# EAGLE design Solar_Panel_Board_v5_1 (EAGLE 9.6.2)
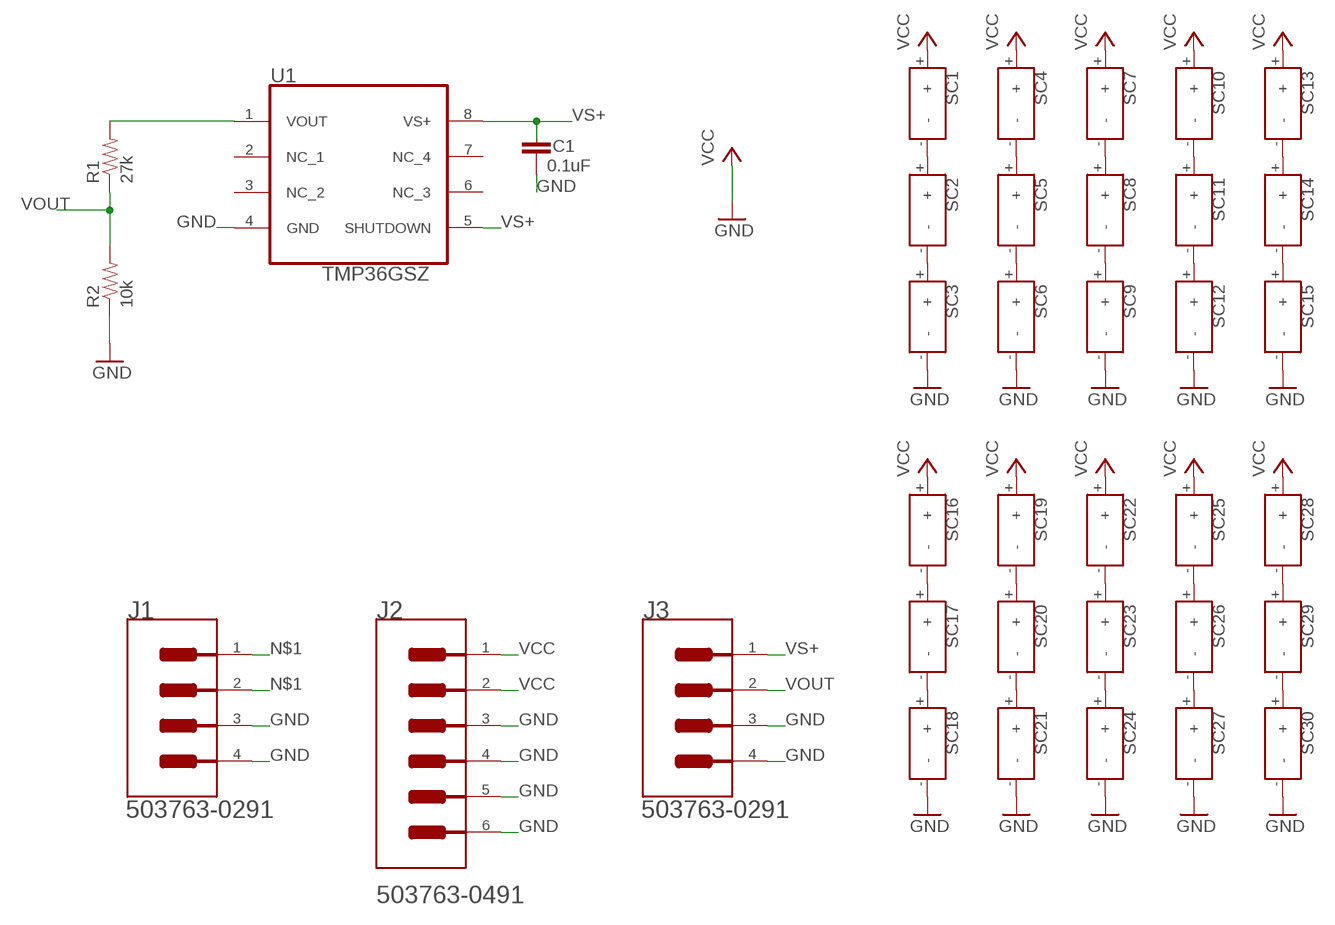
[diagram p0: schematic, sheet 1]

## Parts
C1  0.1uF  CAP0805  [0805]
J1  MOLEX_503763-0291MOLEX_503763-0291_0_0  [MOLEX_503763-0291_0]
J2  MOLEX_503763-0491MOLEX_503763-0491_0_0  [MOLEX_503763-0491_0]
J3  MOLEX_503763-0291MOLEX_503763-0291_0_0  [MOLEX_503763-0291_0]
R1  27k  RESISTOR0805-RES  [0805]
R2  10k  RESISTOR0805-RES  [0805]
SC1  KXOB25-05X3F  [KXOB25-05X3F]
SC2  KXOB25-05X3F  [KXOB25-05X3F]
SC3  KXOB25-05X3F  [KXOB25-05X3F]
SC4  KXOB25-05X3F  [KXOB25-05X3F]
SC5  KXOB25-05X3F  [KXOB25-05X3F]
SC6  KXOB25-05X3F  [KXOB25-05X3F]
SC7  KXOB25-05X3F  [KXOB25-05X3F]
SC8  KXOB25-05X3F  [KXOB25-05X3F]
SC9  KXOB25-05X3F  [KXOB25-05X3F]
SC10  KXOB25-05X3F  [KXOB25-05X3F]
SC11  KXOB25-05X3F  [KXOB25-05X3F]
SC12  KXOB25-05X3F  [KXOB25-05X3F]
SC13  KXOB25-05X3F  [KXOB25-05X3F]
SC14  KXOB25-05X3F  [KXOB25-05X3F]
SC15  KXOB25-05X3F  [KXOB25-05X3F]
SC16  KXOB25-05X3F  [KXOB25-05X3F]
SC17  KXOB25-05X3F  [KXOB25-05X3F]
SC18  KXOB25-05X3F  [KXOB25-05X3F]
SC19  KXOB25-05X3F  [KXOB25-05X3F]
SC20  KXOB25-05X3F  [KXOB25-05X3F]
SC21  KXOB25-05X3F  [KXOB25-05X3F]
SC22  KXOB25-05X3F  [KXOB25-05X3F]
SC23  KXOB25-05X3F  [KXOB25-05X3F]
SC24  KXOB25-05X3F  [KXOB25-05X3F]
SC25  KXOB25-05X3F  [KXOB25-05X3F]
SC26  KXOB25-05X3F  [KXOB25-05X3F]
SC27  KXOB25-05X3F  [KXOB25-05X3F]
SC28  KXOB25-05X3F  [KXOB25-05X3F]
SC29  KXOB25-05X3F  [KXOB25-05X3F]
SC30  KXOB25-05X3F  [KXOB25-05X3F]
U1  TMP36GSZ  [SOIC127P600X175-8N]

## Nets
GND: C1.2 J1.3(MNT_1) J1.4(MNT_2) J2.3 J2.4 J2.5(MNT_1) J2.6(MNT_2) J3.3(MNT_1) J3.4(MNT_2) R2.1 SC3.- SC6.- SC9.- SC12.- SC15.- SC18.- SC21.- SC24.- SC27.- SC30.- U1.4(GND)
N$1: J1.1 J1.2
N$2: SC7.- SC8.+
N$3: SC4.- SC5.+
N$4: SC5.- SC6.+
N$5: SC2.- SC3.+
N$6: SC1.- SC2.+
N$7: SC8.- SC9.+
N$8: SC16.- SC17.+
N$9: SC14.- SC15.+
N$10: SC13.- SC14.+
N$11: SC10.- SC11.+
N$12: R1.2 U1.1(VOUT)
N$13: SC11.- SC12.+
N$14: SC23.- SC24.+
N$15: SC20.- SC21.+ SC22.- SC23.+
N$18: SC17.- SC18.+
N$19: SC19.- SC20.+
N$21: SC28.- SC29.+
N$22: SC29.- SC30.+
N$23: SC26.- SC27.+
N$24: SC25.- SC26.+
VCC: J2.1 J2.2 SC1.+ SC4.+ SC7.+ SC10.+ SC13.+ SC16.+ SC19.+ SC22.+ SC25.+ SC28.+ ; supply symbol labelled GND
VOUT: J3.2 R1.1 R2.2
VS+: C1.1 J3.1 U1.5(SHUTDOWN) U1.8(VS+)
Unconnected: U1.2(NC_1) U1.3(NC_2) U1.6(NC_3) U1.7(NC_4)

## Library data of the parts
C1 = HSFL_Main_Library:CAP: Capacitor Standard 0603 ceramic capacitor, and 0.1" leaded capacitor.
J1 J3 = Molex - 503763-0291:MOLEX_503763-0291: 2 Positions Header Connector 0.039" (1.00mm) Surface Mount, Right Angle Gold; CENTROID_NOT_SPECIFIED: No; DATASHEET: http://www.molex.com/pdm_docs/sd/5037630291_sd.pdf; DIGIKEY_DESCRIPTION: CONN HEADER 1MM R/A 2CKT; DIGIKEY_PART_NUMBER: WM10654CT-ND; LEAD_FREE: yes; MF: Molex; MOUSER_PART_NUMBER: 538-503763-0291; MPN: 503763-0291; PACKAGE: HDR02; PREFIX: J; ROHS: yes; TEMPERATURE_RANGE_HIGH: +105°C; TEMPERATURE_RANGE_LOW: -40°C
J2 = Molex - 503763-0491:MOLEX_503763-0491: Wire-To-Board Connector, Pico-Lock 503763 Series, Surface Mount, Header, 4 Contacts, 1 mm; AUTOMOTIVE: No; CENTROID_NOT_SPECIFIED: No; CONN_GENDER: Male; CONN_ORIENTATION: Right Angle; CONTACT_MATERIAL: Gold,Nickel; CURRENT_RATING: 1.5A; DATASHEET: https://www.molex.com/webdocs/datasheets/pdf/en-us/5037630491_PCB_HEADERS.pdf; DEVICE_CLASS_L1: Connectors; DEVICE_CLASS_L2: Headers and Wire Housings; DEVICE_CLASS_L3: unset; DIGIKEY_DESCRIPTION: CONN HEADER 1MM R/A 4CKT; DIGIKEY_PART_NUMBER: WM10655CT-ND; FOOTPRINT_URL: https://www.molex.com/pdm_docs/sd/5037630491_sd.pdf; FOOTPRINT_VARIANT_NAME_0: Recommended_Land_Pattern; HEIGHT: 1.7mm; LEAD_FREE: Yes; MF: Molex; MFG_PACKAGE_IDENT: 503763-0491; MFG_PACKAGE_IDENT_DATE: 0; MFG_PACKAGE_IDENT_REV: 0; MOUSER_PART_NUMBER: 538-503763-0491; MPN: 503763-0491; NUMBER_OF_CONTACTS: 4; NUMBER_OF_ROWS: 1; PACKAGE: HDR4; PITCH: 1mm; PREFIX: J; ROHS: Yes; TEMPERATURE_RANGE_HIGH: +105°C; TEMPERATURE_RANGE_LOW: -40°C; VERIFICATION_VERSION: 0.0.0.1; VOLTAGE_RATING: 150V
R1 R2 = HSFL_Main_Library:RESISTOR: Resistor Basic schematic elements and footprints for 0603, 1206, and PTH resistors.
SC1-SC30 = untitled:KXOB25-05X3F: KXOB25-05X3F - Monocrystalline Solar Cell 30.7mW, 2.07V
U1 = TMP36GSZ:TMP36GSZ

## Board
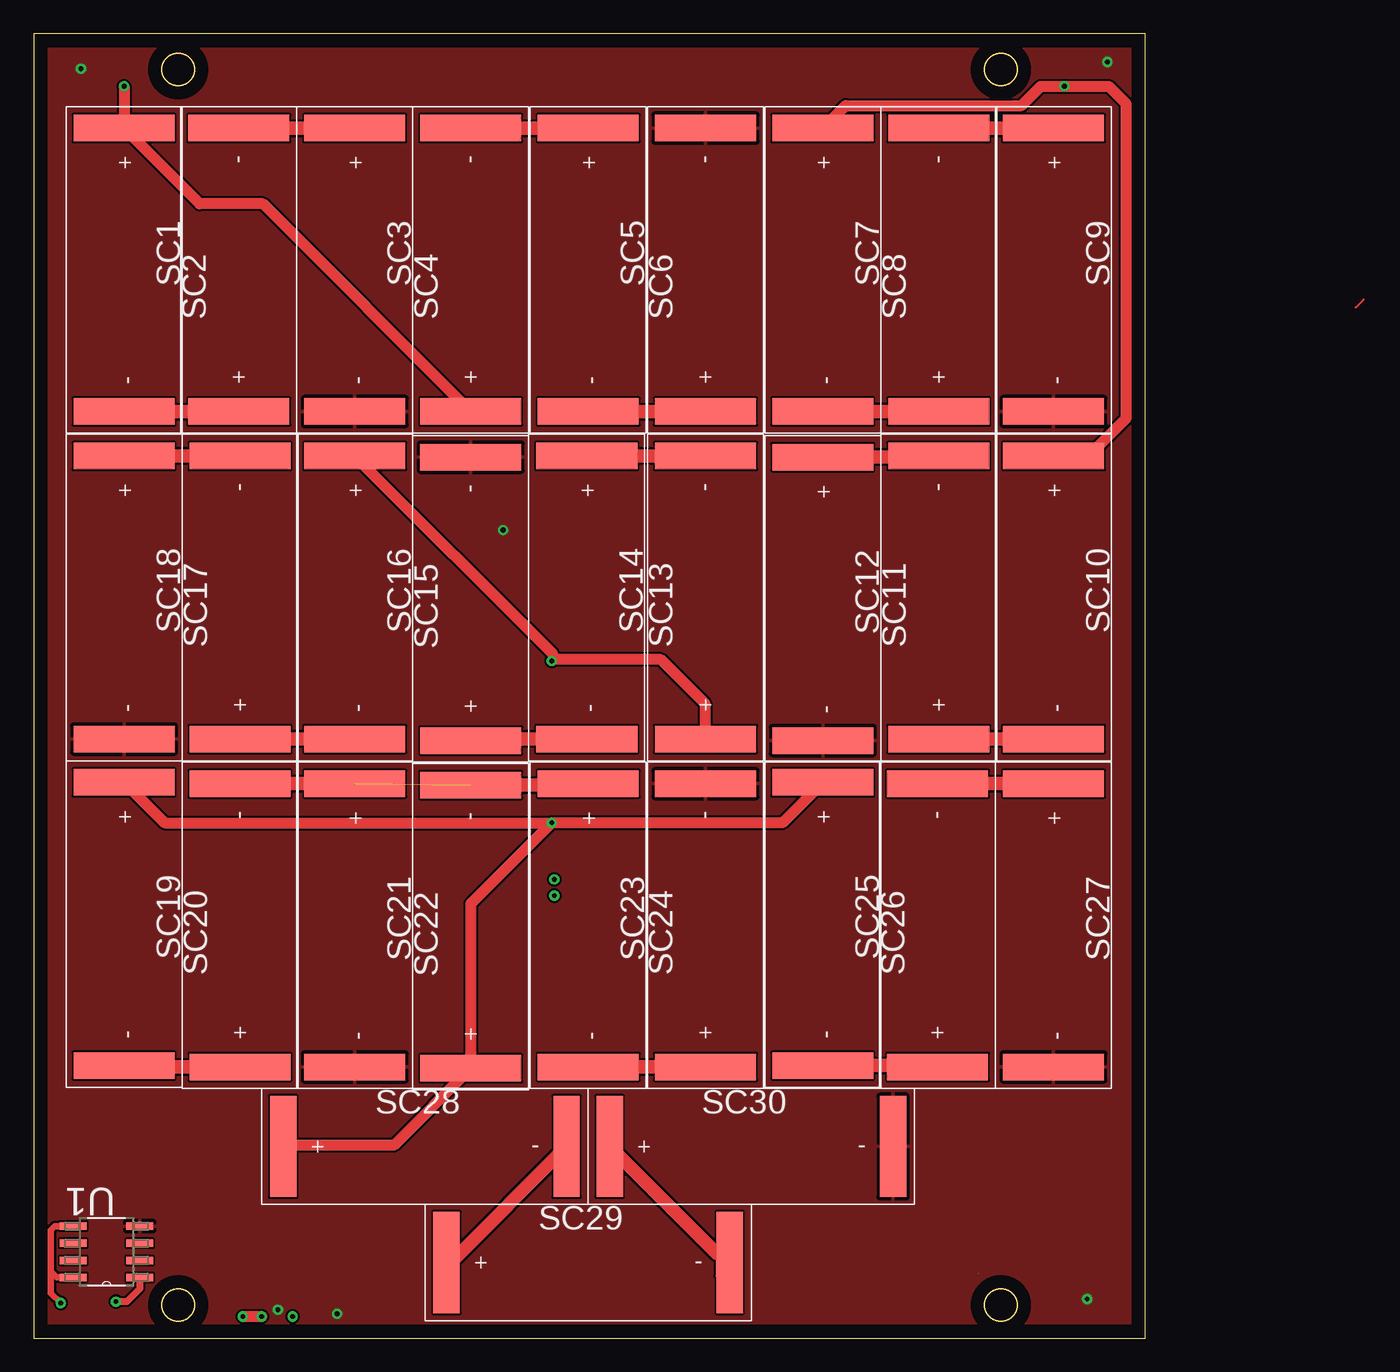
[diagram p1: board, top side]
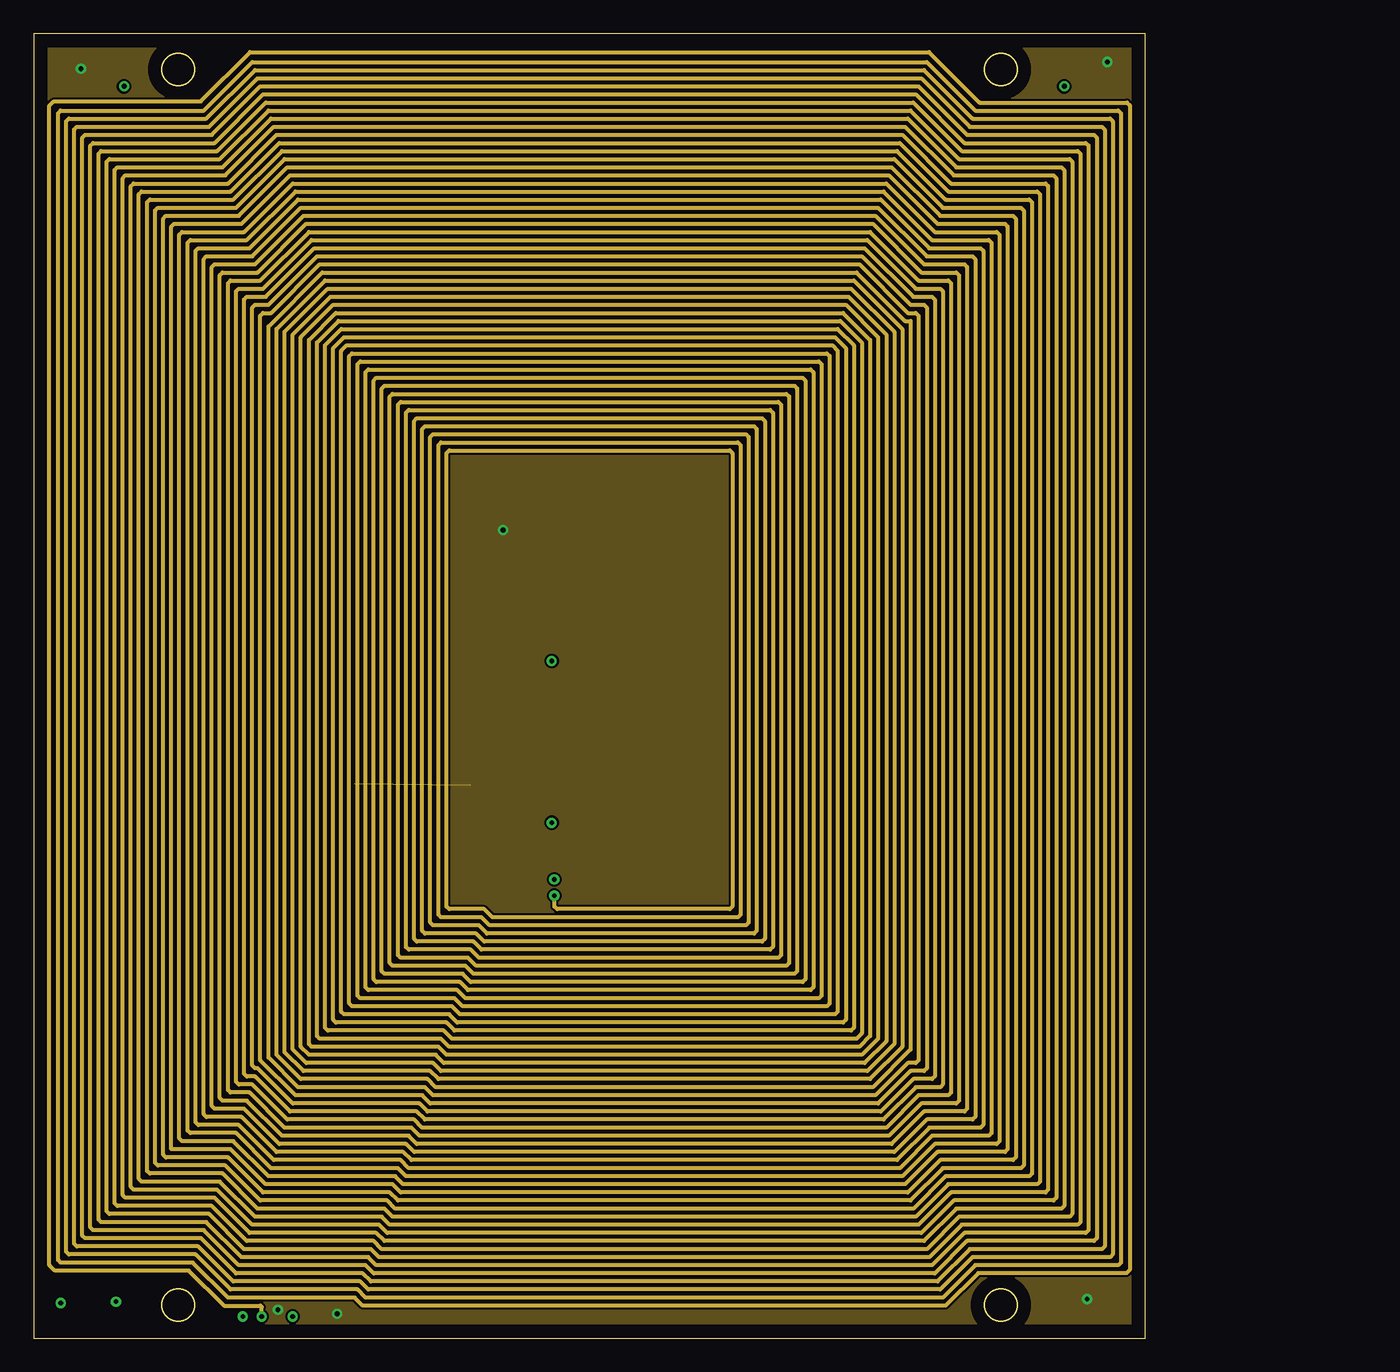
[diagram p2: board, inner layer Route2]
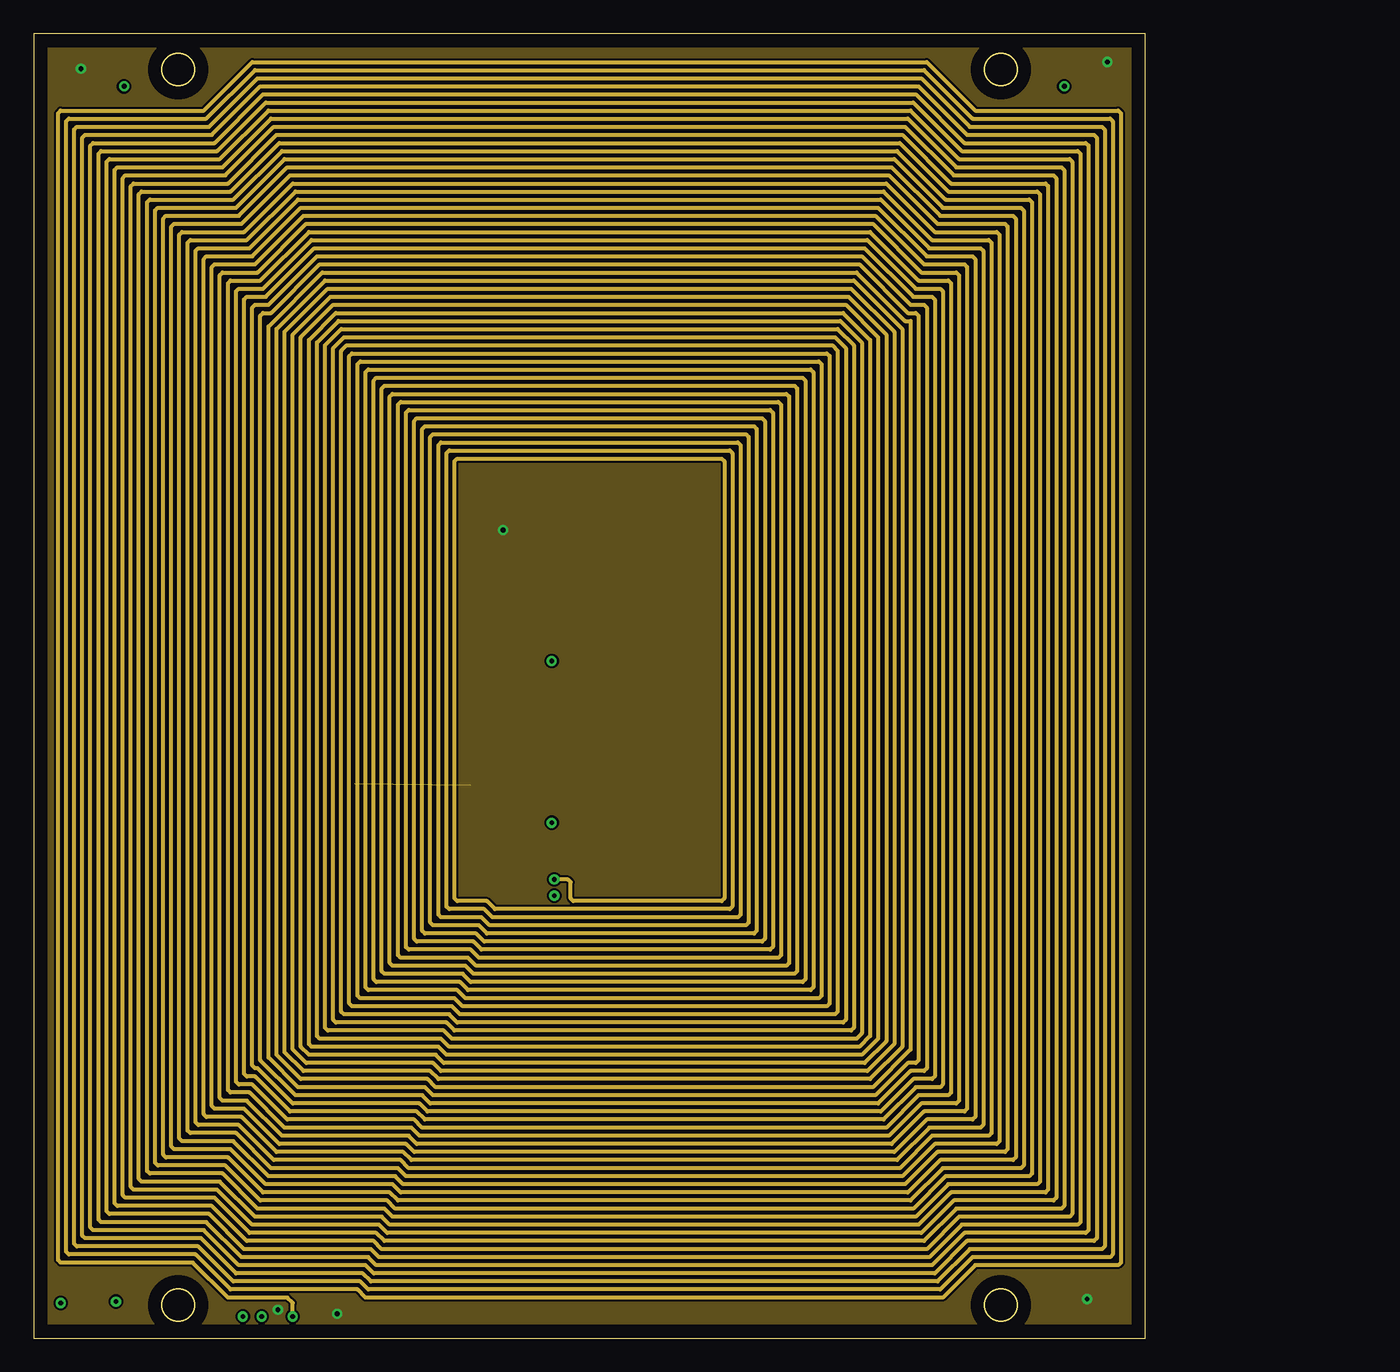
[diagram p3: board, inner layer Route3]
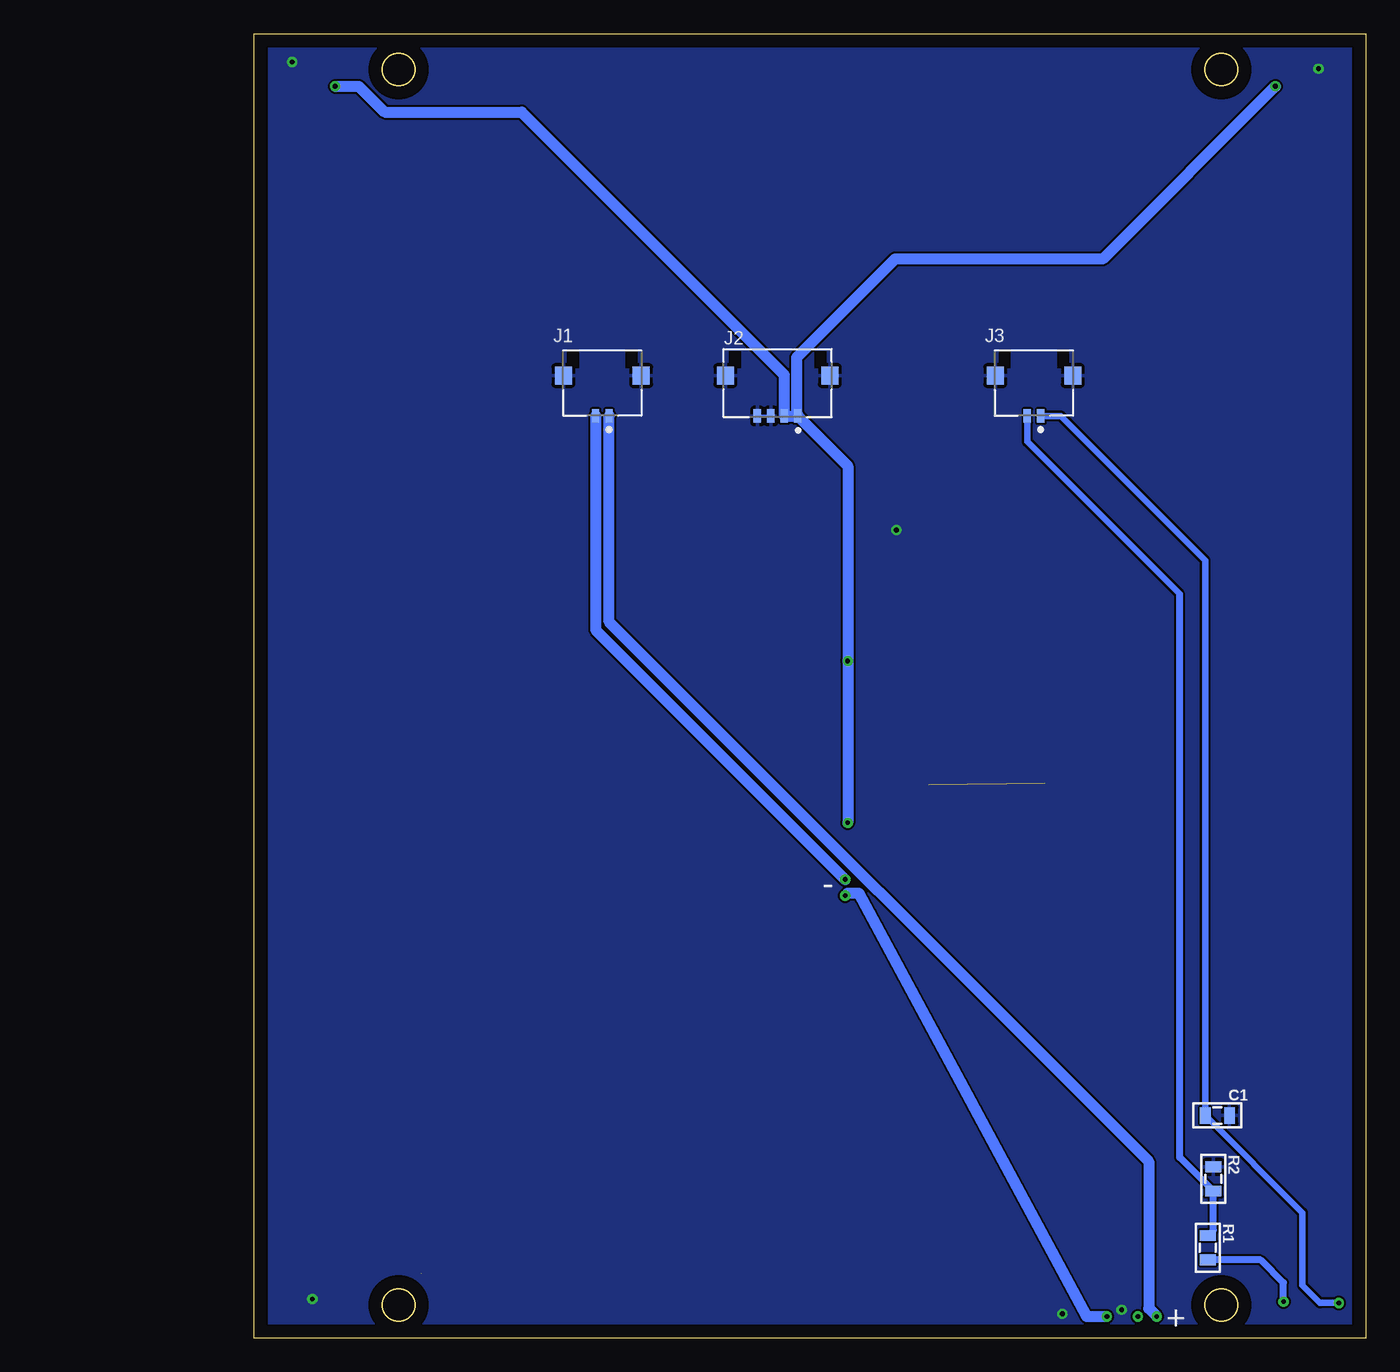
[diagram p4: board, bottom side, seen from below]

Size 82.42 x 96.7 mm. Coordinates in mm from the lower left corner, seen from the top.
Outline: 82.42,96.7 0,96.7 0,0 82.42,0 82.42,96.7
Outline: circle at 10.71,2.45 radius 1.2
Outline: circle at 71.71,2.45 radius 1.2
Outline: circle at 71.71,94.05 radius 1.2
Outline: circle at 10.71,94.05 radius 1.2
Copper layers (1+2*3+16): Top 0.035mm / dielectric 1.5mm / Route2 0.035mm / dielectric 0.15mm / Route3 0.035mm / dielectric 0.2mm / Bottom 0.035mm
Design rules "default *": minimum track width 6mil, minimum drill 0.35mm, track to track 6mil, track to pad 6mil, pad to pad 6mil, via to via 6mil, smd to smd 6mil, copper to edge 40mil, drill to drill 6mil, minimum pad ring 10mil, minimum via ring 8mil, stop-mask expansion 4mil, vias tented up to drill 0mil, thermal gap 10mil
Holes 2.4 mm at 10.71,94.05 71.71,94.05 10.71,2.45 71.71,2.45

### Footprints (pad centres in the part's own frame; a part is rotated, then mirrored left to right if it is on the bottom)
0805 = smd 0.8 x 1.2: 1 -0.9,0; 2 0.9,0
MOLEX_503763-0291_0 = smd 0.55 x 1: 1 0.5,-2.435; 2 -0.5,-2.435 | smd 1.26 x 1.3: 3 -2.875,0.555; 4 2.875,0.555
MOLEX_503763-0491_0 = smd 0.55 x 1: 1 1.5,-2.435; 2 0.5,-2.435; 3 -0.5,-2.435; 4 -1.5,-2.435 | smd 1.26 x 1.3: 5 -3.875,0.555; 6 3.875,0.555
KXOB25-05X3F = smd 1.96 x 7.49: + -10.5,0; - 10.5,0
SOIC127P600X175-8N = smd 1.981 x 0.559: 1 -2.464,1.905; 2 -2.464,0.635; 3 -2.464,-0.635; 4 -2.464,-1.905; 5 2.464,-1.905; 6 2.464,-0.635; 7 2.464,0.635; 8 2.464,1.905

### Placement (x,y rotation side)
C1  11,16.5 0 bottom
J1  56.6,70.8 0 bottom
J2  43.6,70.8 0 bottom
J3  24.6,70.8 0 bottom
R1  11.7,6.7 270 bottom
R2  11.3,11.8 270 bottom
SC1  6.7,79.2 270 top
SC2  15.2,79.2 90 top
SC3  23.8,79.2 270 top
SC4  32.4,79.2 90 top
SC5  41.1,79.2 270 top
SC6  49.8,79.2 90 top
SC7  58.5,79.2 270 top
SC8  67.1,79.2 90 top
SC9  75.6,79.2 270 top
SC10  75.6,54.9 270 top
SC11  67.1,54.9 90 top
SC12  58.5,54.8 270 top
SC13  49.8,54.9 90 top
SC14  41,54.9 270 top
SC15  32.4,54.8 90 top
SC16  23.8,54.9 270 top
SC17  15.3,54.9 90 top
SC18  6.7,54.9 270 top
SC19  6.7,30.7 270 top
SC20  15.3,30.6 90 top
SC21  23.8,30.6 270 top
SC22  32.4,30.5 90 top
SC23  41.1,30.6 270 top
SC24  49.8,30.6 90 top
SC25  58.5,30.7 270 top
SC26  67,30.6 90 top
SC27  75.6,30.6 270 top
SC28  29,14.2 0 top
SC29  41.1,5.6 0 top
SC30  53.2,14.2 0 top
U1  5.4,6.4 180 top

### Tracks (layer width: path | path; a pad name or v marks a point on that pad's centre or on a via)
GND  (via drill 0.35)
  Top 0.152: SC12.- 58.5,44.4 | 21.2,68.7 SC3.- 26.5,68.7
  Bottom 0.152: J2.3 J2.4
  other vias: 22.5,1.8 18.1,2.1 34.8,59.9 78.1,2.9 79.6,94.6 3.5,94.1
  pour Top: -1,98 84,98 84,-1 -1,-1
  pour Route2: -2,99 85,99 85,-2 -2,-2
  pour Route3: -3,100 86,100 86,-3 -3,-3
  pour Bottom: -4,101 87,101 87,-4 -4,-4
N$1  (via drill 0.35)  (1 unrouted)
  Top 0.813: v15.5,1.6 v16.9,1.6
  Route2 0.3: v16.9,1.6 16.9,2.3 16.8,2.4 14.11,2.4 11.51,5 1.57,5 1.17,5.4 1.17,91.37 1.48,91.68 12.39,91.68 16.04,95.33 66.38,95.33 70.11,91.6 81.05,91.6 81.25,91.4 81.25,5.05 81.02,4.82 70.03,4.82 | 70.02,4.82 67.6,2.4 24.4,2.4 23.8,3 14.4,3 11.8,5.6 2,5.6 1.8,5.8 1.8,90.8 2,91 12.6,91 16.2,94.6 66.2,94.6 69.8,91 80.4,91 80.6,90.8 80.6,5.6 80.4,5.4 69.8,5.4 67.4,3 24.6,3 24,3.6 14.6,3.6 12,6.2 2.6,6.2 2.4,6.4 2.4,90.2 2.6,90.4 12.8,90.4 16.4,94 66,94 69.6,90.4 79.8,90.4 80,90.2 80,6.2 79.8,6 69.6,6 67.2,3.6 24.8,3.6 24.2,4.2 14.8,4.2 12.2,6.8 3.2,6.8 3,7 3,89.6 3.2,89.8 13,89.8 16.6,93.4 65.8,93.4 69.4,89.8 79.2,89.8 79.4,89.6 79.4,6.8 79.2,6.6 69.4,6.6 67,4.2 25,4.2 24.4,4.8 15,4.8 12.4,7.4 3.8,7.4 3.6,7.6 3.6,89 3.8,89.2 13.2,89.2 16.8,92.8 65.6,92.8 69.2,89.2 78.6,89.2 78.8,89 78.8,7.4 78.6,7.2 69.2,7.2 66.8,4.8 25.2,4.8 24.6,5.4 15.2,5.4 12.6,8 4.4,8 4.2,8.2 4.2,88.4 4.4,88.6 13.4,88.6 17,92.2 65.4,92.2 69,88.6 78,88.6 78.2,88.4 78.2,8 78,7.8 69,7.8 66.6,5.4 25.4,5.4 24.8,6 15.4,6 12.8,8.6 5,8.6 4.8,8.8 4.8,87.8 5,88 13.6,88 17.2,91.6 65.2,91.6 68.8,88 77.4,88 77.6,87.8 77.6,8.6 77.4,8.4 68.8,8.4 66.4,6 25.6,6 25,6.6 15.6,6.6 13,9.2 5.6,9.2 5.4,9.4 5.4,87.2 5.6,87.4 13.8,87.4 17.4,91 65,91 68.6,87.4 76.8,87.4 77,87.2 77,9.2 76.8,9 68.6,9 66.2,6.6 25.8,6.6 25.2,7.2 15.8,7.2 13.2,9.8 6.2,9.8 6,10 6,86.6 6.2,86.8 14,86.8 17.6,90.4 64.8,90.4 68.4,86.8 76.2,86.8 76.4,86.6 76.4,9.8 76.2,9.6 68.4,9.6 66,7.2 26,7.2 25.4,7.8 16,7.8 13.4,10.4 6.8,10.4 6.6,10.6 6.6,86 6.8,86.2 14.2,86.2 17.8,89.8 64.6,89.8 68.2,86.2 75.6,86.2 75.8,86 75.8,10.4 75.6,10.2 68.2,10.2 65.8,7.8 26.2,7.8 25.6,8.4 16.2,8.4 13.6,11 7.4,11 7.2,11.2 7.2,85.4 7.4,85.6 14.4,85.6 18,89.2 64.4,89.2 68,85.6 75,85.6 75.2,85.4 75.2,11 75,10.8 68,10.8 65.6,8.4 26.4,8.4 25.8,9 16.4,9 13.8,11.6 8,11.6 7.8,11.8 7.8,84.8 8,85 14.6,85 18.2,88.6 64.2,88.6 67.8,85 74.4,85 74.6,84.8 74.6,11.6 74.4,11.4 67.8,11.4 65.4,9 26.6,9 26,9.6 16.6,9.6 14,12.2 8.6,12.2 8.4,12.4 8.4,84.2 8.6,84.4 14.8,84.4 18.4,88 64,88 67.6,84.4 73.8,84.4 74,84.2 74,12.2 73.8,12 67.6,12 65.2,9.6 26.8,9.6 26.2,10.2 16.8,10.2 14.2,12.8 9.2,12.8 9,13 9,83.6 9.2,83.8 15,83.8 18.6,87.4 63.8,87.4 67.4,83.8 73.2,83.8 73.4,83.6 73.4,12.8 73.2,12.6 67.4,12.6 65,10.2 27,10.2 26.4,10.8 17,10.8 14.4,13.4 9.8,13.4 9.6,13.6 9.6,83 9.8,83.2 15.2,83.2 18.8,86.8 63.6,86.8 67.2,83.2 72.6,83.2 72.8,83 72.8,13.4 72.6,13.2 67.2,13.2 64.8,10.8 27.2,10.8 26.6,11.4 17.2,11.4 14.6,14 10.2,14 10.2,82.4 10.4,82.6 15.4,82.6 19,86.2 63.4,86.2 67,82.6 72,82.6 72.2,82.4 72.2,14 72,13.8 67,13.8 64.6,11.4 27.4,11.4 26.8,12 17.4,12 14.8,14.6 11,14.6 10.8,14.8 10.8,81.8 11,82 15.6,82 19.2,85.6 63.2,85.6 66.8,82 71.4,82 71.6,81.8 71.6,14.6 71.4,14.4 66.8,14.4 64.4,12 27.6,12 27,12.6 17.6,12.6 15,15.2 11.6,15.2 11.4,15.4 11.4,81.2 11.6,81.4 15.8,81.4 19.4,85 63,85 66.6,81.4 70.8,81.4 71,81.2 71,15.2 70.8,15 66.6,15 64.2,12.6 27.8,12.6 27.2,13.2 17.8,13.2 15.2,15.8 12.2,15.8 12,16 12,80.6 12.2,80.8 16,80.8 19.6,84.4 62.8,84.4 66.4,80.8 70.2,80.8 70.4,80.6 70.4,15.8 70.2,15.6 66.4,15.6 64,13.2 28,13.2 27.4,13.8 18,13.8 15.4,16.4 12.8,16.4 12.6,16.6 12.6,80 12.8,80.2 16.2,80.2 19.8,83.8 62.6,83.8 66.2,80.2 69.6,80.2 69.8,80 69.8,16.4 69.6,16.2 66.2,16.2 63.8,13.8 28.2,13.8 27.6,14.4 18.2,14.4 15.6,17 13.4,17 13.2,17.2 13.2,79.4 13.4,79.6 16.4,79.6 20,83.2 62.4,83.2 66,79.6 69,79.6 69.2,79.4 69.2,17 69,16.8 66,16.8 63.6,14.4 28.4,14.4 27.8,15 18.4,15 15.8,17.6 14,17.6 13.8,17.8 13.8,78.8 14,79 16.6,79 20.2,82.6 62.2,82.6 65.8,79 68.4,79 68.6,78.8 68.6,17.6 68.4,17.4 65.8,17.4 63.4,15 28.6,15 28,15.6 18.6,15.6 16,18.2 14.6,18.2 14.4,18.4 14.4,78.2 14.6,78.4 16.8,78.4 20.4,82 62,82 65.6,78.4 67.8,78.4 68,78.2 68,18.2 67.8,18 65.6,18 63.2,15.6 28.8,15.6 28.2,16.2 18.8,16.2 16.2,18.8 15.2,18.8 15,19 15,77.6 15.2,77.8 17,77.8 20.6,81.4 61.8,81.4 65.4,77.8 67.2,77.8 67.4,77.6 67.4,18.8 67.2,18.6 65.4,18.6 63,16.2 29,16.2 28.4,16.8 19,16.8 16.4,19.4 15.8,19.4 15.6,19.6 15.6,77 15.8,77.2 17.2,77.2 20.8,80.8 61.6,80.8 65.2,77.2 66.6,77.2 66.8,77 66.8,19.4 66.6,19.2 65.2,19.2 62.8,16.8 29.2,16.8 28.6,17.4 19.2,17.4 16.6,20 16.4,20 16.2,20.2 16.2,76.4 16.4,76.6 17.4,76.6 21,80.2 61.4,80.2 65,76.6 66,76.6 66.2,76.4 66.2,20 66,19.8 65,19.8 62.6,17.4 29.4,17.4 28.8,18 19.4,18 16.8,20.6 16.8,75.8 17,76 17.6,76 21.2,79.6 61.2,79.6 64.8,76 65.4,76 65.6,75.8 65.6,20.6 65.4,20.4 64.8,20.4 62.4,18 29.6,18 29,18.6 19.6,18.6 17.4,20.8 17.4,75 21.4,79 61,79 64.6,75.4 65,75.4 65,21.4 62.2,18.6 29.8,18.6 29.2,19.2 19.8,19.2 18,21 18,74.8 21.6,78.4 60.8,78.4 64.4,74.8 64.4,21.6 62,19.2 30,19.2 29.4,19.8 20,19.8 18.6,21.2 18.6,74.6 21.8,77.8 60.6,77.8 63.8,74.6 63.8,21.8 61.8,19.8 30.2,19.8 29.6,20.4 20.2,20.4 19.2,21.4 19.2,74.4 22,77.2 60.4,77.2 63.2,74.4 63.2,22 61.6,20.4 30.4,20.4 29.8,21 20.4,21 19.8,21.6 19.8,74.2 22.2,76.6 60.2,76.6 62.6,74.2 62.6,22.2 61.4,21 30.6,21 30,21.6 20.6,21.6 20.4,21.8 20.4,74 22.4,76 60,76 62,74 62,22.4 61.2,21.6 30.8,21.6 30.2,22.2 21.2,22.2 21,22.4 21,73.8 22.6,75.4 59.8,75.4 61.4,73.8 61.4,22.6 61,22.2 31,22.2 30.4,22.8 21.8,22.8 21.6,23 21.6,73.6 22.8,74.8 59.6,74.8 60.8,73.6 60.8,23 60.6,22.8 31.2,22.8 30.6,23.4 22.4,23.4 22.2,23.6 22.2,73.4 23,74.2 59.4,74.2 60.2,73.4 60.2,23.6 60,23.4 31.4,23.4 30.8,24 23,24 22.8,24.2 22.8,73.2 23.2,73.6 59.2,73.6 59.6,73.2 59.6,24.2 59.4,24 31.6,24 31,24.6 23.6,24.6 23.4,24.8 23.4,72.8 23.6,73 58.8,73 59,72.8 59,24.8 58.8,24.6 31.8,24.6 31.2,25.2 24.2,25.2 24,25.4 24,72.2 24.2,72.4 58.2,72.4 58.4,72.2 58.4,25.4 58.2,25.2 32,25.2 31.4,25.8 24.8,25.8 24.6,26 24.6,71.6 24.8,71.8 57.6,71.8 57.8,71.6 57.8,26 57.6,25.8 32.2,25.8 31.6,26.4 25.4,26.4 25.2,26.6 25.2,71 25.4,71.2 57,71.2 57.2,71 57.2,26.6 57,26.4 32.4,26.4 31.8,27 26,27 25.8,27.2 25.8,70.4 26,70.6 56.4,70.6 56.6,70.4 56.6,27.2 56.4,27 32.6,27 32,27.6 26.6,27.6 26.4,27.8 26.4,69.8 26.6,70 55.8,70 56,69.8 56,27.8 55.8,27.6 32.8,27.6 32.2,28.2 27.2,28.2 27,28.4 27,69.2 27.2,69.4 55.2,69.4 55.4,69.2 55.4,28.4 55.2,28.2 33,28.2 32.4,28.8 27.8,28.8 27.6,29 27.6,68.6 27.8,68.8 54.6,68.8 54.8,68.6 54.8,29 54.6,28.8 33.2,28.8 32.6,29.4 28.4,29.4 28.2,29.6 28.2,68 28.4,68.2 54,68.2 54.2,68 54.2,29.6 54,29.4 33.4,29.4 32.8,30 29,30 28.8,30.2 28.8,67.4 29,67.6 53.4,67.6 53.6,67.4 53.6,30.2 53.4,30 33.6,30 33,30.6 29.6,30.6 29.4,30.8 29.4,66.8 29.6,67 52.8,67 53,66.8 53,30.8 52.8,30.6 33.8,30.6 33.2,31.2 30.2,31.2 30,31.4 30,66.2 30.2,66.4 52.2,66.4 52.4,66.2 52.4,31.4 52.2,31.2 34,31.2 33.4,31.8 30.8,31.8 30.6,32 30.6,65.6 30.8,65.8 51.6,65.8 51.8,65.6 51.8,32 51.6,31.8 38.8,31.8 38.6,32 v38.6,32.8
  Route3 0.3: v38.6,34 39.6,34 39.8,33.8 39.8,32.6 40,32.4 51,32.4 51.2,32.6 51.2,65 51,65.2 31.4,65.2 31.2,65 31.2,32.6 31.4,32.4 33.6,32.4 34.2,31.8 51.6,31.8 51.8,32 51.8,65.6 51.6,65.8 30.8,65.8 30.6,65.6 30.6,32 30.8,31.8 33.4,31.8 34,31.2 52.2,31.2 52.4,31.4 52.4,66.2 52.2,66.4 30.2,66.4 30,66.2 30,31.4 30.2,31.2 33.2,31.2 33.8,30.6 52.8,30.6 53,30.8 53,66.8 52.8,67 29.6,67 29.4,66.8 29.4,30.8 29.6,30.6 33,30.6 33.6,30 53.4,30 53.6,30.2 53.6,67.4 53.4,67.6 29,67.6 28.8,67.4 28.8,30.2 29,30 32.8,30 33.4,29.4 54,29.4 54.2,29.6 54.2,68 54,68.2 28.4,68.2 28.2,68 28.2,29.6 28.4,29.4 32.6,29.4 33.2,28.8 54.6,28.8 54.8,29 54.8,68.6 54.6,68.8 27.8,68.8 27.6,68.6 27.6,29 27.8,28.8 32.4,28.8 33,28.2 55.2,28.2 55.4,28.4 55.4,69.2 55.2,69.4 27.2,69.4 27,69.2 27,28.4 27.2,28.2 32.2,28.2 32.8,27.6 55.8,27.6 56,27.8 56,69.8 55.8,70 26.6,70 26.4,69.8 26.4,27.8 26.6,27.6 32,27.6 32.6,27 56.4,27 56.6,27.2 56.6,70.4 56.4,70.6 26,70.6 25.8,70.4 25.8,27.2 26,27 31.8,27 32.4,26.4 57,26.4 57.2,26.6 57.2,71 57,71.2 25.4,71.2 25.2,71 25.2,26.6 25.4,26.4 31.6,26.4 32.2,25.8 57.6,25.8 57.8,26 57.8,71.6 57.6,71.8 24.8,71.8 24.6,71.6 24.6,26 24.8,25.8 31.4,25.8 32,25.2 58.2,25.2 58.4,25.4 58.4,72.2 58.2,72.4 24.2,72.4 24,72.2 24,25.4 24.2,25.2 31.2,25.2 31.8,24.6 58.8,24.6 59,24.8 59,72.8 58.8,73 23.6,73 23.4,72.8 23.4,24.8 23.6,24.6 31,24.6 31.6,24 59.4,24 59.6,24.2 59.6,73.2 59.2,73.6 23.2,73.6 22.8,73.2 22.8,24.2 23,24 30.8,24 31.4,23.4 60,23.4 60.2,23.6 60.2,73.4 59.4,74.2 23,74.2 22.2,73.4 22.2,23.6 22.4,23.4 30.6,23.4 31.2,22.8 60.6,22.8 60.8,23 60.8,73.6 59.6,74.8 22.8,74.8 21.6,73.6 21.6,23 21.8,22.8 30.4,22.8 31,22.2 61,22.2 61.4,22.6 61.4,73.8 59.8,75.4 22.6,75.4 21,73.8 21,22.4 21.2,22.2 30.2,22.2 30.8,21.6 61.2,21.6 62,22.4 62,74 60,76 22.4,76 20.4,74 20.4,21.8 20.6,21.6 30,21.6 30.6,21 61.4,21 62.6,22.2 62.6,74.2 60.2,76.6 22.2,76.6 19.8,74.2 19.8,21.6 20.4,21 29.8,21 30.4,20.4 61.6,20.4 63.2,22 63.2,74.4 60.4,77.2 22,77.2 19.2,74.4 19.2,21.4 20.2,20.4 29.6,20.4 30.2,19.8 61.8,19.8 63.8,21.8 63.8,74.6 60.6,77.8 21.8,77.8 18.6,74.6 18.6,21.2 20,19.8 29.4,19.8 30,19.2 62,19.2 64.4,21.6 64.4,74.8 60.8,78.4 21.6,78.4 18,74.8 18,21 19.8,19.2 29.2,19.2 29.8,18.6 62.2,18.6 65,21.4 65,75.4 64.6,75.4 61,79 21.4,79 17.4,75 17.4,20.8 19.6,18.6 29,18.6 29.6,18 62.4,18 64.8,20.4 65.4,20.4 65.6,20.6 65.6,75.8 65.4,76 64.8,76 61.2,79.6 21.2,79.6 17.6,76 17,76 16.8,75.8 16.8,20.6 19.4,18 28.8,18 29.4,17.4 62.6,17.4 65,19.8 66,19.8 66.2,20 66.2,76.4 66,76.6 65,76.6 61.4,80.2 21,80.2 17.4,76.6 16.4,76.6 16.2,76.4 16.2,20.2 16.4,20 16.6,20 19.2,17.4 28.6,17.4 29.2,16.8 62.8,16.8 65.2,19.2 66.6,19.2 66.8,19.4 66.8,77 66.6,77.2 65.2,77.2 61.6,80.8 20.8,80.8 17.2,77.2 15.8,77.2 15.6,77 15.6,19.6 15.8,19.4 16.4,19.4 19,16.8 28.4,16.8 29,16.2 63,16.2 65.4,18.6 67.2,18.6 67.4,18.8 67.4,77.6 67.2,77.8 65.4,77.8 61.8,81.4 20.6,81.4 17,77.8 15.2,77.8 15,77.6 15,19 15.2,18.8 16.2,18.8 18.8,16.2 28.2,16.2 28.8,15.6 63.2,15.6 65.6,18 67.8,18 68,18.2 68,78.2 67.8,78.4 65.6,78.4 62,82 20.4,82 16.8,78.4 14.6,78.4 14.4,78.2 14.4,18.4 14.6,18.2 16,18.2 18.6,15.6 28,15.6 28.6,15 63.4,15 65.8,17.4 68.4,17.4 68.6,17.6 68.6,78.8 68.4,79 65.8,79 62.2,82.6 20.2,82.6 16.6,79 14,79 13.8,78.8 13.8,17.8 14,17.6 15.8,17.6 18.4,15 27.8,15 28.4,14.4 63.6,14.4 66,16.8 69,16.8 69.2,17 69.2,79.4 69,79.6 66,79.6 62.4,83.2 20,83.2 16.4,79.6 13.4,79.6 13.2,79.4 13.2,17.2 13.4,17 15.6,17 18.2,14.4 27.6,14.4 28.2,13.8 63.8,13.8 66.2,16.2 69.6,16.2 69.8,16.4 69.8,80 69.6,80.2 66.2,80.2 62.6,83.8 19.8,83.8 16.2,80.2 12.8,80.2 12.6,80 12.6,16.6 12.8,16.4 15.4,16.4 18,13.8 27.4,13.8 28,13.2 64,13.2 66.4,15.6 70.2,15.6 70.4,15.8 70.4,80.6 70.2,80.8 66.4,80.8 62.8,84.4 19.6,84.4 16,80.8 12.2,80.8 12,80.6 12,16 12.2,15.8 15.2,15.8 17.8,13.2 27.2,13.2 27.8,12.6 64.2,12.6 66.6,15 70.8,15 71,15.2 71,81.2 70.8,81.4 66.6,81.4 63,85 19.4,85 15.8,81.4 11.6,81.4 11.4,81.2 11.4,15.4 11.6,15.2 15,15.2 17.6,12.6 27,12.6 27.6,12 64.4,12 66.8,14.4 71.4,14.4 71.6,14.6 71.6,81.8 71.4,82 66.8,82 63.2,85.6 19.2,85.6 15.6,82 11,82 10.8,81.8 10.8,14.8 11,14.6 14.8,14.6 17.4,12 26.8,12 27.4,11.4 64.6,11.4 67,13.8 72,13.8 72.2,14 72.2,82.4 72,82.6 67,82.6 63.4,86.2 19,86.2 15.4,82.6 10.4,82.6 10.2,82.4 10.2,14.2 10.4,14 14.6,14 17.2,11.4 26.6,11.4 27.2,10.8 64.8,10.8 67.2,13.2 72.6,13.2 72.8,13.4 72.8,83 72.6,83.2 67.2,83.2 63.6,86.8 18.8,86.8 15.2,83.2 9.8,83.2 9.6,83 9.6,13.6 9.8,13.4 14.4,13.4 17,10.8 26.4,10.8 27,10.2 65,10.2 67.4,12.6 73.2,12.6 73.4,12.8 73.4,83.6 73.2,83.8 67.4,83.8 63.8,87.4 18.6,87.4 15,83.8 9.2,83.8 9,83.6 9,13 9.2,12.8 14.2,12.8 16.8,10.2 26.2,10.2 26.8,9.6 65.2,9.6 67.6,12 73.8,12 74,12.2 74,84.2 73.8,84.4 67.6,84.4 64,88 18.4,88 14.8,84.4 8.6,84.4 8.4,84.2 8.4,12.4 8.6,12.2 14,12.2 16.6,9.6 26,9.6 26.6,9 65.4,9 67.8,11.4 74.4,11.4 74.6,11.6 74.6,84.8 74.4,85 67.8,85 64.2,88.6 18.2,88.6 14.6,85 8,85 7.8,84.8 7.8,11.8 8,11.6 13.8,11.6 16.4,9 25.8,9 26.4,8.4 65.6,8.4 68,10.8 75,10.8 75.2,11 75.2,85.4 75,85.6 68,85.6 64.4,89.2 18,89.2 14.4,85.6 7.4,85.6 7.2,85.4 7.2,11.2 7.4,11 13.6,11 16.2,8.4 25.6,8.4 26.2,7.8 65.8,7.8 68.2,10.2 75.6,10.2 75.8,10.4 75.8,86 75.6,86.2 68.2,86.2 64.6,89.8 17.8,89.8 14.2,86.2 6.8,86.2 6.6,86 6.6,10.6 6.8,10.4 13.4,10.4 16,7.8 25.4,7.8 26,7.2 66,7.2 68.4,9.6 76.2,9.6 76.4,9.8 76.4,86.6 76.2,86.8 68.4,86.8 64.8,90.4 17.6,90.4 14,86.8 6.2,86.8 6,86.6 6,10 6.2,9.8 13.2,9.8 15.8,7.2 25.2,7.2 25.8,6.6 66.2,6.6 68.6,9 76.8,9 77,9.2 77,87.2 76.8,87.4 68.6,87.4 65,91 17.4,91 13.8,87.4 5.6,87.4 5.4,87.2 5.4,9.4 5.6,9.2 13,9.2 15.6,6.6 25,6.6 25.6,6 66.4,6 68.8,8.4 77.4,8.4 77.6,8.6 77.6,87.8 77.4,88 68.8,88 65.2,91.6 17.2,91.6 13.6,88 5,88 4.8,87.8 4.8,8.8 5,8.6 12.8,8.6 15.4,6 24.8,6 25.4,5.4 66.6,5.4 69,7.8 78,7.8 78.2,8 78.2,88.4 78,88.6 69,88.6 65.4,92.2 17,92.2 13.4,88.6 4.4,88.6 4.2,88.4 4.2,8.2 4.4,8 12.6,8 15.2,5.4 24.6,5.4 25.2,4.8 66.8,4.8 69.2,7.2 78.6,7.2 78.8,7.4 78.8,89 78.6,89.2 69.2,89.2 65.6,92.8 16.8,92.8 13.2,89.2 3.8,89.2 3.6,89 3.6,7.6 3.8,7.4 12.4,7.4 15,4.8 24.4,4.8 25,4.2 67,4.2 69.4,6.6 79.2,6.6 79.4,6.8 79.4,89.6 79.2,89.8 69.4,89.8 65.8,93.4 16.6,93.4 13,89.8 3.2,89.8 3,89.6 3,7 3.2,6.8 12.2,6.8 14.8,4.2 24.2,4.2 24.8,3.6 67.2,3.6 69.6,6 79.8,6 80,6.2 80,90.2 79.8,90.4 69.6,90.4 66,94 16.4,94 12.8,90.4 2.6,90.4 2.4,90.2 2.4,6.4 2.6,6.2 12,6.2 14.6,3.6 24,3.6 24.6,3 67.4,3 69.8,5.4 80.4,5.4 80.6,5.6 80.6,90.8 80.4,91 69.8,91 66.2,94.6 16.2,94.6 12.6,91 2,91 1.8,90.8 1.8,5.8 2,5.6 11.8,5.6 14.4,3 18.8,3 19.2,2.6 v19.2,1.6
  Bottom 0.3: v38.6,32.8 38.4,33
  Bottom 0.813: 38.4,33 37.6,33 20.71,1.6 v19.2,1.6 | J1.2 57.1,52.5 v38.6,34 | J1.1 56.1,53.1 16.1,13.1 16.1,2.2 v15.5,1.6
N$2
  Top 1.016: SC8.+ SC7.-
N$3
  Top 0.152: SC5.+ 41.5,89.7 41.7,89.5 41.3,89.5 SC5.+
  Top 1.016: SC4.- SC5.+
N$4
  Top 1.016: SC5.- SC6.+
N$5
  Top 1.016: SC2.- SC3.+
N$6
  Top 0.152: SC2.+ 15.3,68.7 15.7,68.3 15.6,68.3 SC2.+
  Top 1.016: SC1.- SC2.+
N$7
  Top 1.016: SC8.- SC9.+
N$8
  Top 1.016: SC16.- SC17.+
N$9
  Top 0.152: 32.5,44.4 SC15.+
  Top 1.016: SC14.- 32.5,44.4
N$10
  Top 1.016: SC13.- SC14.+
N$11
  Top 1.016: SC10.- SC11.+
N$12  (via drill 0.35)
  Top 0.508: U1.1 7.86,3.66 6.9,2.7 v6.1,2.7
  Bottom 0.508: v6.1,2.7 6.1,4.1 7.8,5.8 R1.2
N$13
  Top 0.152: SC11.- 67,65.3
  Top 1.016: 67,65.3 SC12.+
N$14
  Top 1.016: SC23.- SC24.+
N$15  (1 unrouted)
  Top 0.152: 41,41 SC23.+
  Top 1.016: SC20.- SC21.+ | SC22.- 41,41
N$18
  Top 1.016: SC17.- SC18.+
N$19
  Top 0.152: SC19.- 6.8,20.1
  Top 1.016: 6.8,20.1 SC20.+
N$21
  Top 0.152: 30.9,5.6 SC29.+
  Top 1.016: SC28.- 30.9,5.6
N$22
  Top 0.152: 50.6,6.3 50.6,4.6 SC29.-
  Top 1.016: SC30.+ 50.6,6.3
N$23
  Top 1.016: SC26.- SC27.+
N$24
  Top 0.152: 66.9,20.2 SC26.+
  Top 1.016: SC25.- 66.9,20.2
N$30
  Top 0.152: 98,76.4 98.6,77
VCC  (via drill 0.35)
  Top 0.152: 6.7,90 SC1.+
  Top 0.508: SC28.+ 18.6,14.3 | v38.4,50.2 38.5,50.3 38.5,50.7
  Top 0.813: v38.4,38.2 32.4,32.2 SC22.+ 26.7,14.3 18.6,14.3 | v6.7,92.8 6.7,90 | SC7.+ 60.18,91.38 73.24,91.38 74.66,92.8 v76.4,92.8 79.7,92.8 81,91.5 81,68.2 78.2,65.4 SC10.+ | SC4.+ 17,84.1 12.3,84.1 SC1.+ | SC13.+ 49.8,47 46.5,50.3 38.5,50.3 | SC16.+ 38.5,50.7 | SC19.+ 9.7,38.2 v38.4,38.2 | SC25.+ 55.5,38.2 v38.4,38.2
  Bottom 0.813: J2.1 J2.2 43.1,71.4 62.58,90.88 72.73,90.88 74.65,92.8 v76.4,92.8 | J2.1 38.4,64.67 v38.4,50.2 v38.4,38.2 | J2.1 42.1,68.47 42.2,68.56 42.2,72.7 34.9,80 19.5,80 v6.7,92.8
VOUT
  Bottom 0.5: 13.8,55.15 25.1,66.45 J3.2
  Bottom 0.508: R1.1 11.3,8 R2.2 13.8,13.4 13.8,55.15
VS+  (via drill 0.35)
  Top 0.5: U1.5 1.57,8.3 1.27,8 1.27,4.93 | U1.8 1.71,4.5 1.27,4.93 | 1.27,4.93 1.27,3.33 v2,2.6
  Bottom 0.5: v2,2.6 3.4,2.6 4.7,3.9 4.7,9.3 C1.1 11.9,57.65 22.61,68.36 J3.1

### Text on the board
bNames: - | +